# Altium schematic sheet v2_shc.SchDoc
size A4
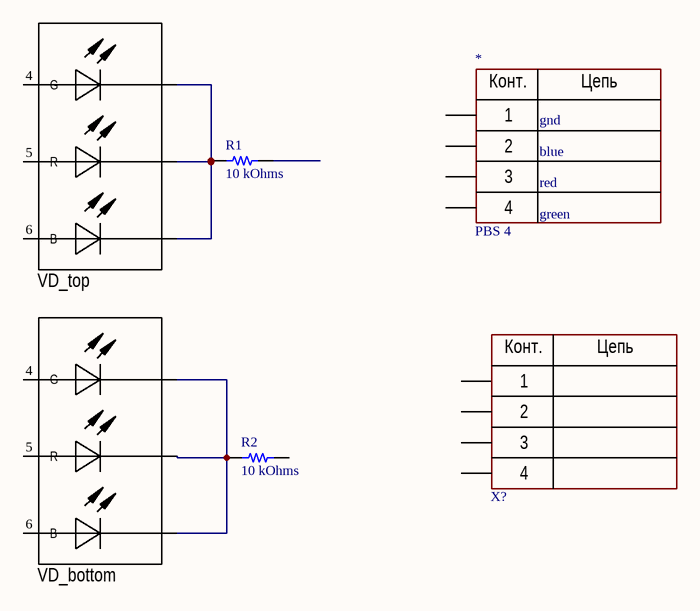
[diagram p0: v2_shc.SchDoc]

## Parts
*  PBS 4  [PBS-4 RIGHT ANGLE]
R1  10 kOhms  [RES 0603_1608]
R2  10 kOhms  [RES 0603_1608]
VD_bottom  VD?  [RGB]  (value not drawn)
VD_top  VD?  [RGB]  (value not drawn)
X?  PLS 4  [pls-4 right angle]  (value not drawn)

## Nets
NetR1_1: R1.1 VD_top.1(G) VD_top.2(G) VD_top.3(G)
NetR2_1: R2.1 VD_bottom.1(G) VD_bottom.2(G) VD_bottom.3(G)

Not connected (* = marked no-connect by the designer): * 1 2 3 4; R1 2; R2 2; VD_bottom 4(G) 5(R) 6(B); VD_top 4(G) 5(R) 6(B); X? 1 2 3 4

## Notes on the sheet
- gnd
- blue
- red
- green
- (in symbol PBS 4) Конт.; Цепь
- (in symbol PLS 4) Конт.; Цепь

## Library data of the parts
R1 R2 = RNCS0603BKE10K0: RES 10K OHM 0.1% 1/16W 0603; Manufacturer: Stackpole Electronics Inc; Power (Watts): 0.063W, 1/16W; Temperature Coefficient: ±25ppm/°C; Part Number: RNCS0603BKE10K0; Value: 10 kOhms; ComponentLink1Description: Datasheet; ComponentLink1URL: https://www.seielect.com/catalog/sei-rncs_rnch.pdf; ComponentLink2Description: DigiKey Link; ComponentLink2URL: http://digikey.com/product-detail/en/stackpole-electronics-inc/RNCS0603BKE10K0/RNCS0603BKE10K0CT-ND/1800113; Composition: Thin Film; Device Package: 0603 (1608 Metric); Features: Anti-Corrosive, Automotive AEC-Q200, Moisture Resistant; Height - Seated (Max): 0.022" (0.55mm); LastUpdated: 21.01.2020 0:25:01; Lifecycle Status: Active; Minimum Order: 1; Number of Terminations: 2; Operating Temperature: -55°C ~ 155°C; Package / Case: 0603 (1608 Metric); Packaging: TapeAndReel; PartId: 4838; Part Status: Active; Price: 0.08; Ratings: AEC-Q200; Resistance: 10 kOhms; Series: RNCS; Size / Dimension: 0.061" L x 0.031" W (1.55mm x 0.80mm); Supplier 1: DigiKey; Supplier Part Number 1: RNCS0603BKE10K0CT-ND; Supplier Device Package: 0603; Tolerance: ±0.1%
VD_bottom VD_top = RGB